# EAGLE design sensor (EAGLE 9.6.2)
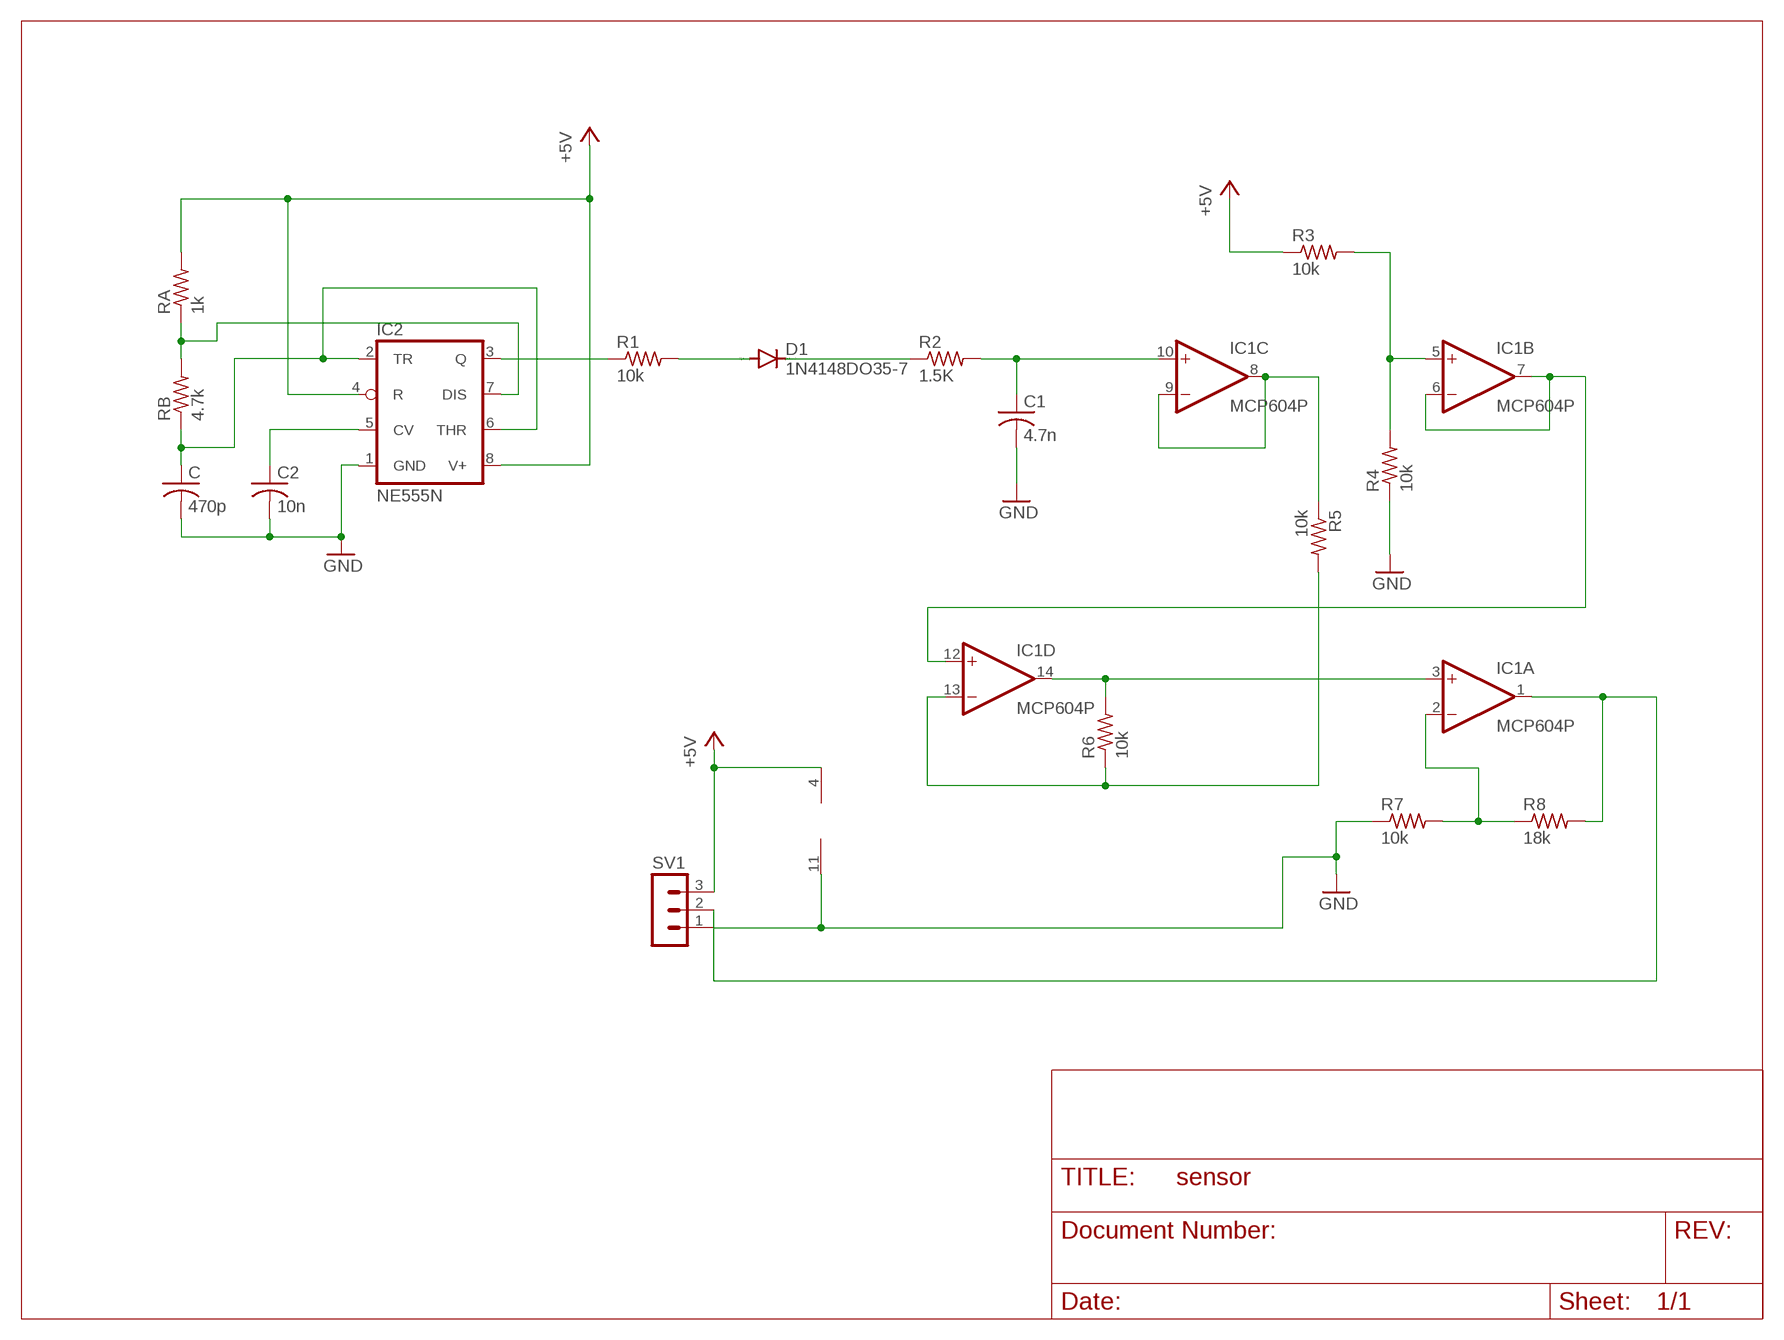
[diagram p0: schematic, sheet 1]

## Parts
C  470p  C-US025-024X044  [C025-024X044]
C1  4.7n  C-US025-024X044  [C025-024X044]
C2  10n  C-US025-024X044  [C025-024X044]
D1  1N4148DO35-7  [DO35-7]
IC1  MCP604P  [DIL14]
IC2  NE555N  [DIL08]
R1  10k  R-US_0204/7  [0204/7]
R2  1.5K  R-US_0204/7  [0204/7]
R3  10k  R-US_0204/7  [0204/7]
R4  10k  R-US_0204/7  [0204/7]
R5  10k  R-US_0204/7  [0204/7]
R6  10k  R-US_0204/7  [0204/7]
R7  10k  R-US_0204/7  [0204/7]
R8  18k  R-US_0204/7  [0204/7]
RA  1k  R-US_0204/7  [0204/7]
RB  4.7k  R-US_0204/7  [0204/7]
SV1  MA03-1  [MA03-1]

## Nets
+5V: IC1.4(P:V+) IC2.4(R) IC2.8(V+) R3.1 RA.2 SV1.3
GND: C1.2 C2.2 C.2 IC1.11(P:V-) IC2.1(GND) R4.1 R7.1 SV1.1
N$1: C2.1 IC2.5(CV)
N$2: C.1 IC2.2(TR) IC2.6(THR) RB.1
N$3: IC2.3(Q) R1.1
N$4: IC2.7(DIS) RA.1 RB.2
N$5: D1.A R1.2
N$6: D1.C R2.1
N$7: C1.1 IC1.10(C:+IN) R2.2
N$8: IC1.13(D:-IN) R5.2 R6.1
N$9: IC1.5(B:+IN) R3.2 R4.2
N$10: IC1.6(B:-IN) IC1.7(B:OUT) IC1.12(D:+IN)
N$11: IC1.8(C:OUT) IC1.9(C:-IN) R5.1
N$12: IC1.3(A:+IN) IC1.14(D:OUT) R6.2
N$13: IC1.1(A:OUT) R8.2 SV1.2
N$14: IC1.2(A:-IN) R7.2 R8.1

## Library data of the parts
C C1 C2 = rcl:C-US: CAPACITOR, American symbol; SPICEPREFIX: C
D1 = diode:1N4148: DIODE high speed (Philips)
IC1 = linear:MCP604: Quad Op Amp 2.7V to 6.0V Single Supply CMOS Source: http://ww1.microchip.com/downloads/en/DeviceDoc/21314g.pdf
IC2 = linear:*555: TIMER
R1-R8 RA RB = rcl:R-US_: RESISTOR, American symbol; SPICEPREFIX: R
SV1 = con-lstb:MA03-1: PIN HEADER; OC_FARNELL: unknown; OC_NEWARK: unknown

## Board
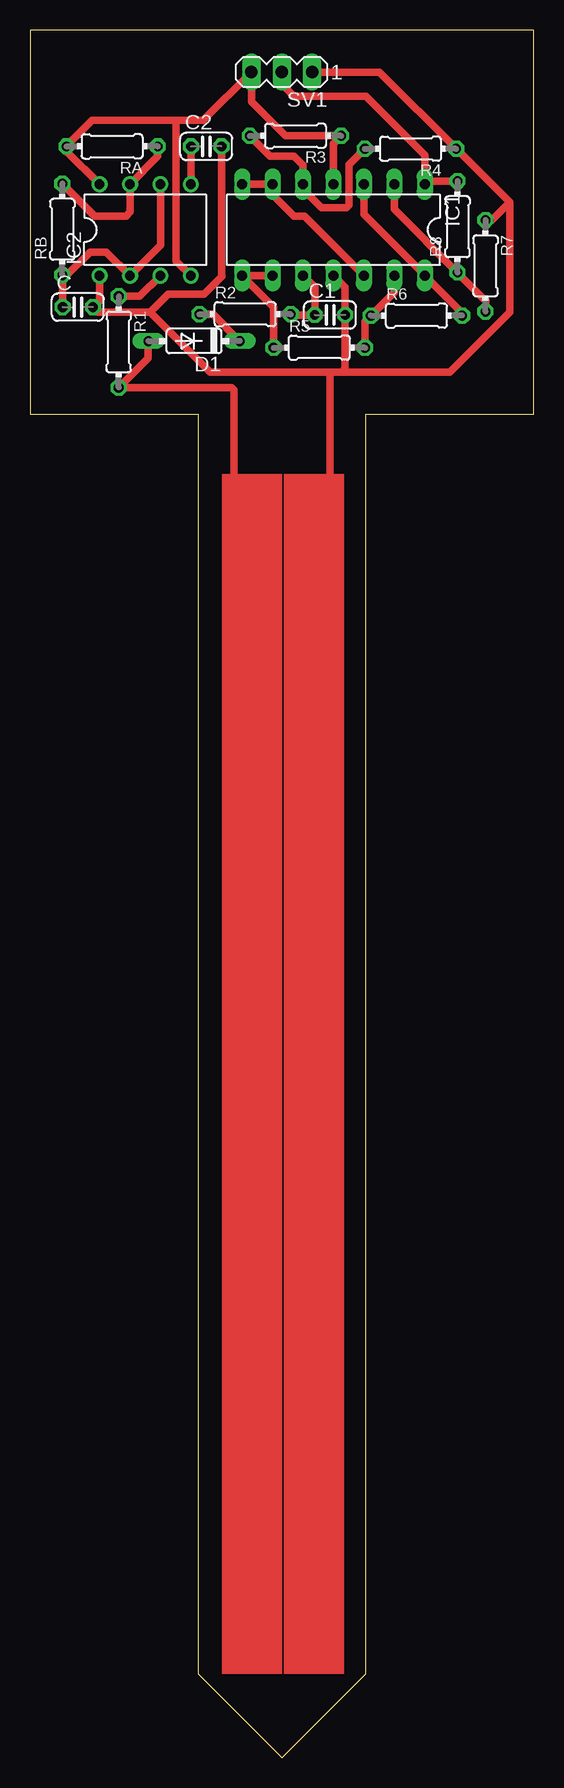
[diagram p1: board, top side]

Size 42 x 144 mm. Coordinates in mm from the lower left corner, seen from the top.
Outline: 0,144 0,112 14,112 14,7 21,0 28,7 28,112 42,112 42,144 0,144
Copper layers (1*16): Top 0.035mm / dielectric 1.5mm / Bottom 0.035mm
Design rules "default": minimum track width 6mil, minimum drill 0.35mm, track to track 6mil, track to pad 6mil, pad to pad 6mil, via to via 6mil, smd to smd 6mil, copper to edge 40mil, drill to drill 6mil, minimum pad ring 10mil, minimum via ring 8mil, stop-mask expansion 4mil, vias tented up to drill 0mil, thermal gap 10mil

### Footprints (pad centres in the part's own frame; a part is rotated, then mirrored left to right if it is on the bottom)
C025-024X044 = drill 0.813 octagon: 1 -1.27,0; 2 1.27,0
DO35-7 = drill 0.813 long: A 3.81,0; C -3.81,0
DIL14 = drill 0.813 long: 1 -7.62,-3.81; 2 -5.08,-3.81; 3 -2.54,-3.81; 4 0,-3.81; 5 2.54,-3.81; 6 5.08,-3.81; 7 7.62,-3.81; 8 7.62,3.81; 9 5.08,3.81; 10 2.54,3.81; 11 0,3.81; 12 -2.54,3.81; 13 -5.08,3.81; 14 -7.62,3.81
DIL08 = drill 0.813 pad 1.27: 1 -3.81,-3.81; 2 -1.27,-3.81; 3 1.27,-3.81; 4 3.81,-3.81; 5 3.81,3.81; 6 1.27,3.81; 7 -1.27,3.81; 8 -3.81,3.81
0204/7 = drill 0.813 octagon: 1 -3.81,0; 2 3.81,0
MA03-1 = drill 1.016 long: 1 -2.54,0; 2 0,0; 3 2.54,0

### Placement (x,y rotation side)
C  3.99,120.9 0 top
C1  25.02,120.25 0 top
C2  14.7,134.3 0 top
D1  13.68,118.07 180 top
IC1  25.31,127.34 180 top
IC2  9.61,127.34 0 top
R1  7.4,118 270 top
R2  17.95,120.31 0 top
R3  22.14,135.18 180 top
R4  31.74,134.1 180 top
R5  24.13,117.52 0 top
R6  32.24,120.19 0 top
R7  37.99,124.34 270 top
R8  35.66,127.6 90 top
RA  6.85,134.3 180 top
RB  2.7,127.38 90 top
SV1  21,140.5 180 top

### Tracks (layer width: path | path; a pad name or v marks a point on that pad's centre or on a via)
+5V
  Top 0.61: IC2.8 3.04,133.91 RA.2 5.2,136.46 12,136.46 | IC1.4 25.31,134.54 R3.1 21.32,135.18 18.46,138.04 SV1.3 14.42,136.46 12,136.46 | IC2.4 12.2,124.75 12.2,136.26 12,136.46
GND
  Top 0.61: IC2.1 5.8,121.44 C.2 5.66,120.5 10,120.5 | IC1.11 26.29,122.55 C1.2 26.29,115.79 26,115.5 | 40,129.65 R4.1 29.15,140.5 SV1.1 | 10,120.5 15,115.5 25,115.5 | 40,129.65 40,120.5 35,115.5 26,115.5 | 26,115.5 25,115.5 | C2.2 15.97,123.53 16,123.5 14.5,122 11.5,122 10,120.5 | R7.1 38.5,128.15 40,129.65 | 25,115.5 25,106
N$1
  Top 0.61: IC2.5 C2.1
N$2
  Top 0.61: IC2.6 10.88,126.07 IC2.2 6.37,125.5 5,125.5 3.07,123.57 RB.1 2.72,123.55 C.1
N$3
  Top 0.61: IC2.3 9.16,121.81 R1.1
N$4
  Top 0.61: RA.1 10.66,133.47 IC2.7 8.34,128.84 8,128.5 5.39,128.5 RB.2
N$5
  Top 0.61: D1.A 9.87,116.66 R1.2 16.81,114.19 17,114 17,106
N$6
  Top 0.61: R2.1 15.25,120.31 D1.C
N$7
  Top 0.61: R2.2 21.82,120.25 C1.1 23.75,122.55 IC1.10
N$8
  Top 0.61: R5.2 27.94,119.7 R6.1 30.4,122.16 IC1.13
N$9
  Top 0.61: R3.2 20.01,133.5 22,133.5 22.77,132.73 IC1.5 22.77,130.73 24.3,129.2 26.4,129.2 26.6,129.4 26.6,132.77 R4.2
N$10
  Top 0.61: IC1.7 IC1.6 20.23,130.27 22,128.5 22.88,128.5 IC1.12
N$11
  Top 0.61: IC1.9 IC1.8 20.32,120.9 R5.1
N$12
  Top 0.61: IC1.3 27.85,128.65 32.93,123.57 IC1.14 36.05,120.41 R6.2
N$13
  Top 0.61: R8.2 33.19,131.41 IC1.1 32.93,133.57 28,138.5 22,138.5 21,139.5 SV1.2
N$14
  Top 0.61: IC1.2 30.39,129.06 R8.1 37.95,121.5 38,121.5 R7.2
(copper drawn outside any net)
  shapes: Top area x2